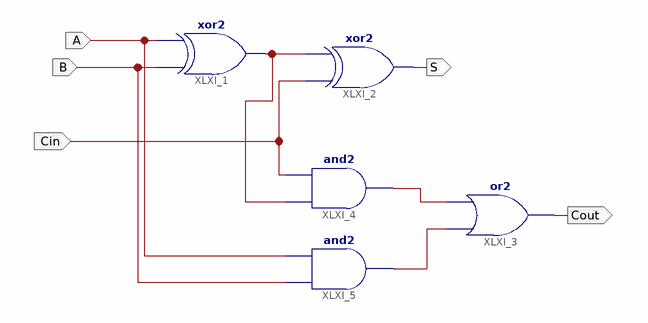
[diagram p0: schematic sheet 1]
// Xilinx ISE schematic full_adder.sch (spartan6) as structural Verilog: 5 symbols, 5 ports
module full_adder (
  input  A,
  input  B,
  input  Cin,
  output S,
  output Cout
);

  wire XLXN_20, XLXN_22, XLXN_23;

  xor XLXI_1 (XLXN_20, B, A);
  xor XLXI_2 (S, Cin, XLXN_20);
  or XLXI_3 (Cout, XLXN_22, XLXN_23);
  and XLXI_4 (XLXN_23, XLXN_20, Cin);
  and XLXI_5 (XLXN_22, B, A);
endmodule
